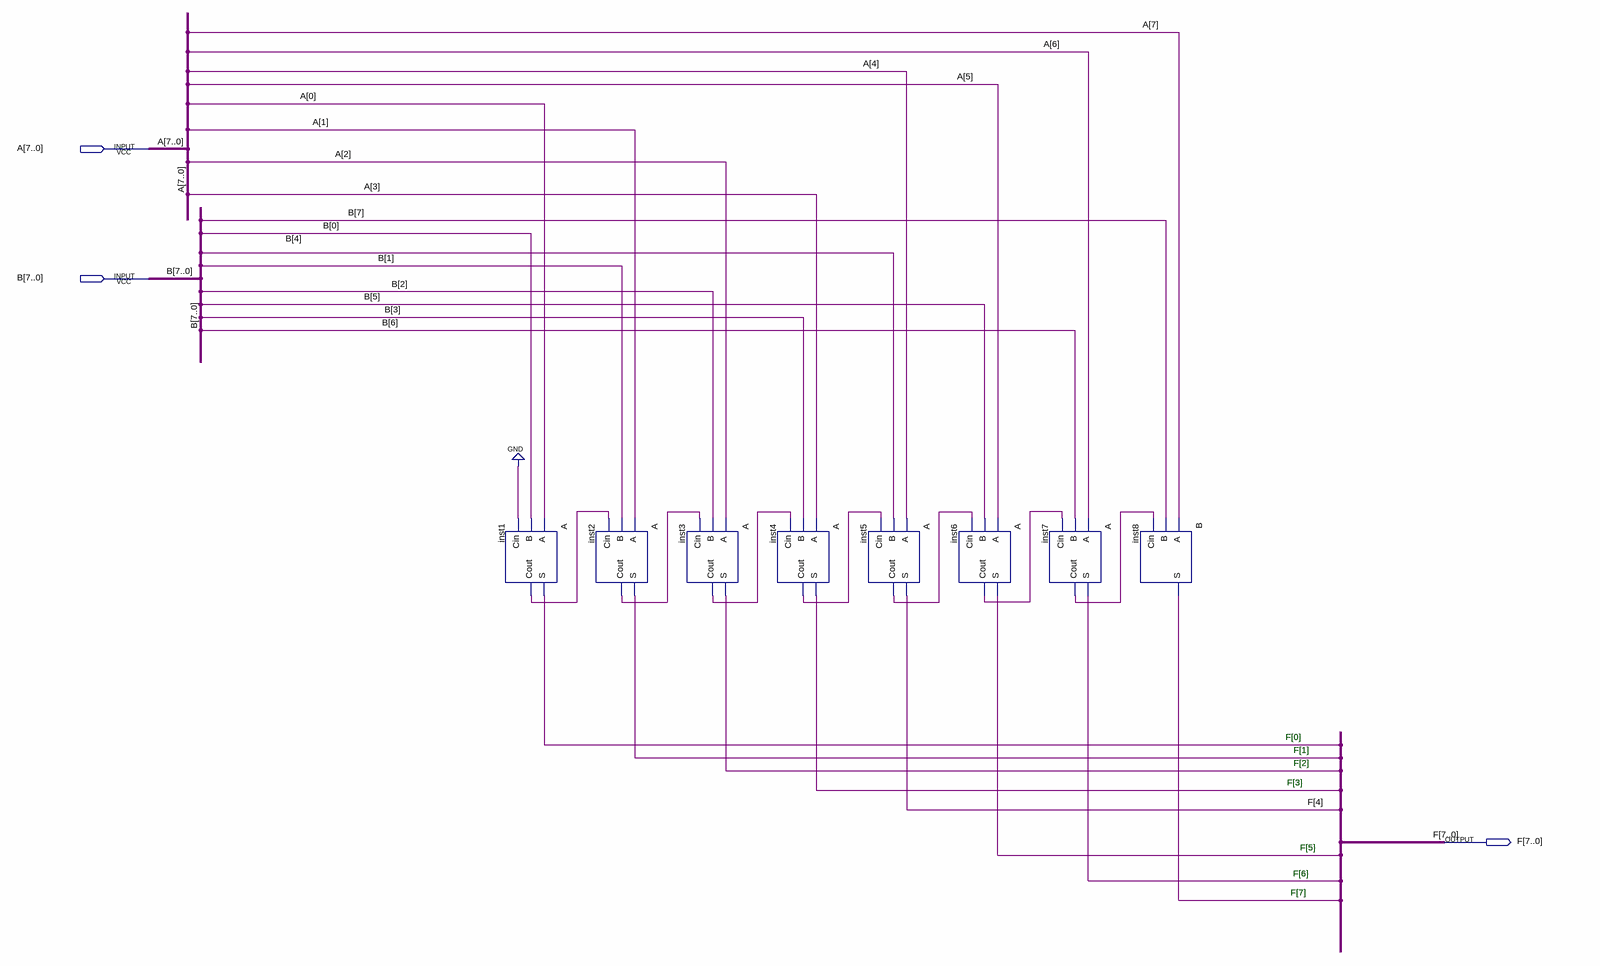
[diagram p0: schematic sheet]
// Quartus schematic AB.bdf as structural Verilog: 8 symbols, 3 pins
module AB (
  input  [7:0] A,
  input  [7:0] B,
  output [7:0] F
);

  wire inst1_cout, inst2_cout, inst3_cout, inst4_cout, inst5_cout, inst6_cout, inst7_cout;

  A inst1 (.A(A[0]), .B(B[0]), .Cin(1'b0), .S(F[0]), .Cout(inst1_cout));
  A inst2 (.A(A[1]), .B(B[1]), .Cin(inst1_cout), .S(F[1]), .Cout(inst2_cout));
  A inst3 (.A(A[2]), .B(B[2]), .Cin(inst2_cout), .S(F[2]), .Cout(inst3_cout));
  A inst4 (.A(A[3]), .B(B[3]), .Cin(inst3_cout), .S(F[3]), .Cout(inst4_cout));
  A inst5 (.A(A[4]), .B(B[4]), .Cin(inst4_cout), .S(F[4]), .Cout(inst5_cout));
  A inst6 (.A(A[5]), .B(B[5]), .Cin(inst5_cout), .S(F[5]), .Cout(inst6_cout));
  A inst7 (.A(A[6]), .B(B[6]), .Cin(inst6_cout), .S(F[6]), .Cout(inst7_cout));
  B inst8 (.A(A[7]), .B(B[7]), .Cin(inst7_cout), .S(F[7]));

  // Notes on the sheet:
  //   F[0]
  //   F[1]
  //   F[2]
  //   F[3]
  //   F[5]
  //   F[6]
  //   F[7]
endmodule
